# EAGLE design max7219-smd-adapter (EAGLE 6.1)
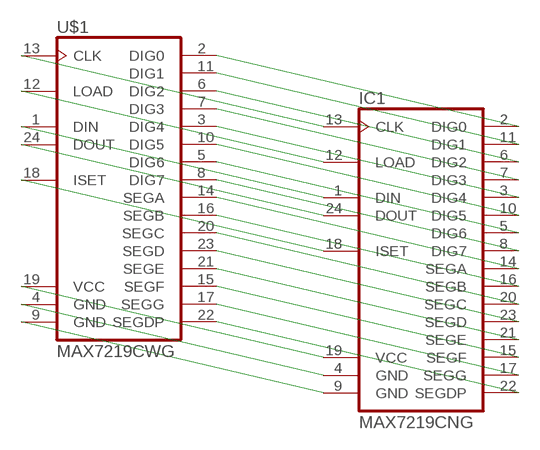
[diagram p0: schematic, sheet 1]

## Parts
IC1  MAX7219CNG  [DIL24-3]
U$1  MAX7219CWG  [SO24L]

## Nets
N$1: IC1.6(DIG2) U$1.6(DIG2)
N$2: IC1.7(DIG3) U$1.7(DIG3)
N$3: IC1.3(DIG4) U$1.3(DIG4)
N$4: IC1.10(DIG5) U$1.10(DIG5)
N$5: IC1.5(DIG6) U$1.5(DIG6)
N$6: IC1.8(DIG7) U$1.8(DIG7)
N$7: IC1.14(SEGA) U$1.14(SEGA)
N$8: IC1.16(SEGB) U$1.16(SEGB)
N$9: IC1.20(SEGC) U$1.20(SEGC)
N$10: IC1.23(SEGD) U$1.23(SEGD)
N$11: IC1.21(SEGE) U$1.21(SEGE)
N$12: IC1.15(SEGF) U$1.15(SEGF)
N$13: IC1.17(SEGG) U$1.17(SEGG)
N$14: IC1.22(SEGDP) U$1.22(SEGDP)
N$15: IC1.11(DIG1) U$1.11(DIG1)
N$16: IC1.2(DIG0) U$1.2(DIG0)
N$17: IC1.1(DIN) U$1.1(DIN)
N$18: IC1.24(DOUT) U$1.24(DOUT)
N$19: IC1.12(LOAD) U$1.12(LOAD)
N$20: IC1.13(CLK) U$1.13(CLK)
N$21: IC1.18(ISET) U$1.18(ISET)
N$22: IC1.9(GND) U$1.9(GND)
N$23: IC1.4(GND) U$1.4(GND)
N$24: IC1.19(VCC) U$1.19(VCC)

## Library data of the parts
IC1 = max7219:MAX7219CNG: LED DISPLAY DRIVER; MF: MAXIM; MPN: MAX7219CNG; OC_FARNELL: 1523914; OC_NEWARK: 34C4018
U$1 = max7219:MAX7219CWG

## Board
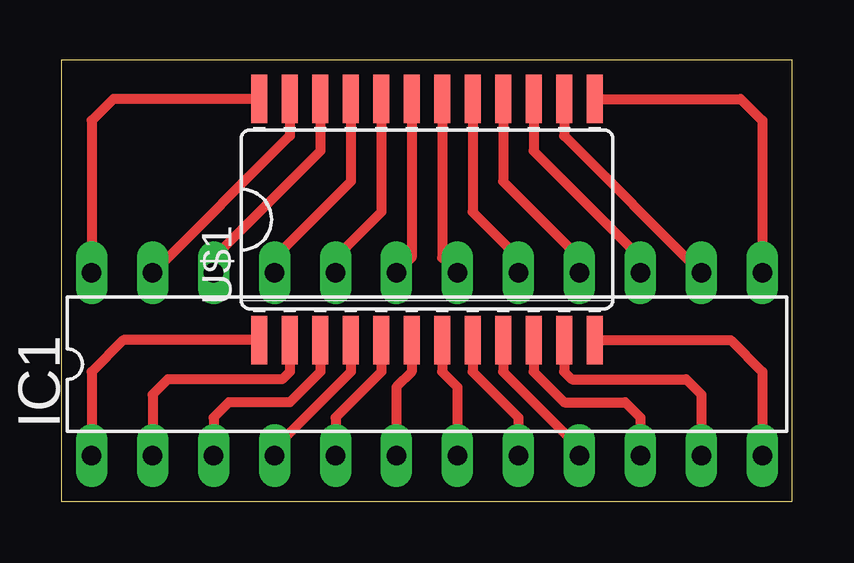
[diagram p1: board, top side]

Size 30.46 x 18.4 mm. Coordinates in mm from the lower left corner, seen from the top.
Outline: 0,0 30.46,0 30.46,18.4 0,18.4 0,0
Copper layers (1*16): Top 0.035mm / dielectric 1.5mm / Bottom 0.035mm
Design rules: minimum track width 10mil, minimum drill 24mil, track to track 12mil, track to pad 12mil, pad to pad 12mil, via to via 12mil, smd to smd 10mil, copper to edge 12mil, drill to drill 12mil, minimum pad ring 10mil, minimum via ring 10mil, stop-mask expansion 4mil, vias tented up to drill 0mil, thermal gap 12mil

### Footprints (pad centres in the part's own frame; a part is rotated, then mirrored left to right if it is on the bottom)
DIL24-3 = drill 0.813 long: 1 -13.97,-3.81; 2 -11.43,-3.81; 3 -8.89,-3.81; 4 -6.35,-3.81; 5 -3.81,-3.81; 6 -1.27,-3.81; 7 1.27,-3.81; 8 3.81,-3.81; 9 6.35,-3.81; 10 8.89,-3.81; 11 11.43,-3.81; 12 13.97,-3.81; 13 13.97,3.81; 14 11.43,3.81; 15 8.89,3.81; 16 6.35,3.81; 17 3.81,3.81; 18 1.27,3.81; 19 -1.27,3.81; 20 -3.81,3.81; 21 -6.35,3.81; 22 -8.89,3.81; 23 -11.43,3.81; 24 -13.97,3.81
SO24L = smd 0.66 x 2.032: 1 -6.985,-5.029; 2 -5.715,-5.029; 3 -4.445,-5.029; 4 -3.175,-5.029; 5 -1.905,-5.029; 6 -0.635,-5.029; 7 0.635,-5.029; 8 1.905,-5.029; 9 3.175,-5.029; 10 4.445,-5.029; 11 5.715,-5.029; 12 6.985,-5.029; 13 6.985,5.029; 14 5.715,5.029; 15 4.445,5.029; 16 3.175,5.029; 17 1.905,5.029; 18 0.635,5.029; 19 -0.635,5.029; 20 -1.905,5.029; 21 -3.175,5.029; 22 -4.445,5.029; 23 -5.715,5.029; 24 -6.985,5.029

### Placement (x,y rotation side)
IC1  15.24,5.71 0 top
U$1  15.24,11.75 0 top

### Tracks (layer width: path | path; a pad name or v marks a point on that pad's centre or on a via)
N$1
  Top 0.406: U$1.6 14.61,5.4 13.97,4.76 IC1.6
N$2
  Top 0.406: U$1.7 15.88,5.4 16.51,4.76 IC1.7
N$3
  Top 0.406: U$1.3 10.79,5.4 9.53,4.13 6.99,4.13 6.35,3.49 IC1.3
N$4
  Top 0.406: U$1.10 19.68,5.4 20.95,4.13 23.5,4.13 24.13,3.49 IC1.10
N$5
  Top 0.406: U$1.5 13.34,5.4 11.43,3.49 IC1.5
N$6
  Top 0.406: U$1.8 17.14,5.4 19.05,3.49 IC1.8
N$7
  Top 0.406: U$1.14 20.95,15.24 IC1.14
N$8
  Top 0.406: U$1.16 18.41,13.34 21.59,10.16 IC1.16
N$9
  Top 0.406: U$1.20 13.34,12.06 11.43,10.16 IC1.20
N$10
  Top 0.406: U$1.23 9.53,15.24 IC1.23
N$11
  Top 0.406: U$1.21 12.06,13.34 8.89,10.16 IC1.21
N$12
  Top 0.406: U$1.15 19.68,14.61 24.13,10.16 IC1.15
N$13
  Top 0.406: U$1.17 17.14,12.06 19.05,10.16 IC1.17
N$14
  Top 0.406: U$1.22 10.79,14.61 6.35,10.16 IC1.22
N$15
  Top 0.406: U$1.11 20.95,5.4 21.27,5.08 26.04,5.08 26.67,4.45 IC1.11
N$16
  Top 0.406: U$1.2 9.53,5.4 9.21,5.08 4.45,5.08 3.81,4.45 IC1.2
N$17
  Top 0.406: U$1.1 2.59,6.72 1.27,5.4 IC1.1
N$18
  Top 0.406: U$1.24 2.17,16.78 1.27,15.88 IC1.24
N$19
  Top 0.406: U$1.12 27.89,6.72 29.21,5.4 IC1.12
N$20
  Top 0.406: U$1.13 28.31,16.78 29.21,15.88 IC1.13
N$21
  Top 0.406: U$1.18 15.88,10.16 IC1.18
N$22
  Top 0.406: U$1.9 18.41,5.4 21.59,2.22 IC1.9
N$23
  Top 0.406: U$1.4 12.06,5.4 8.89,2.22 IC1.4
N$24
  Top 0.406: U$1.19 14.61,10.16 IC1.19